# EAGLE design IMUinator2368 v2 (EAGLE 6.2)
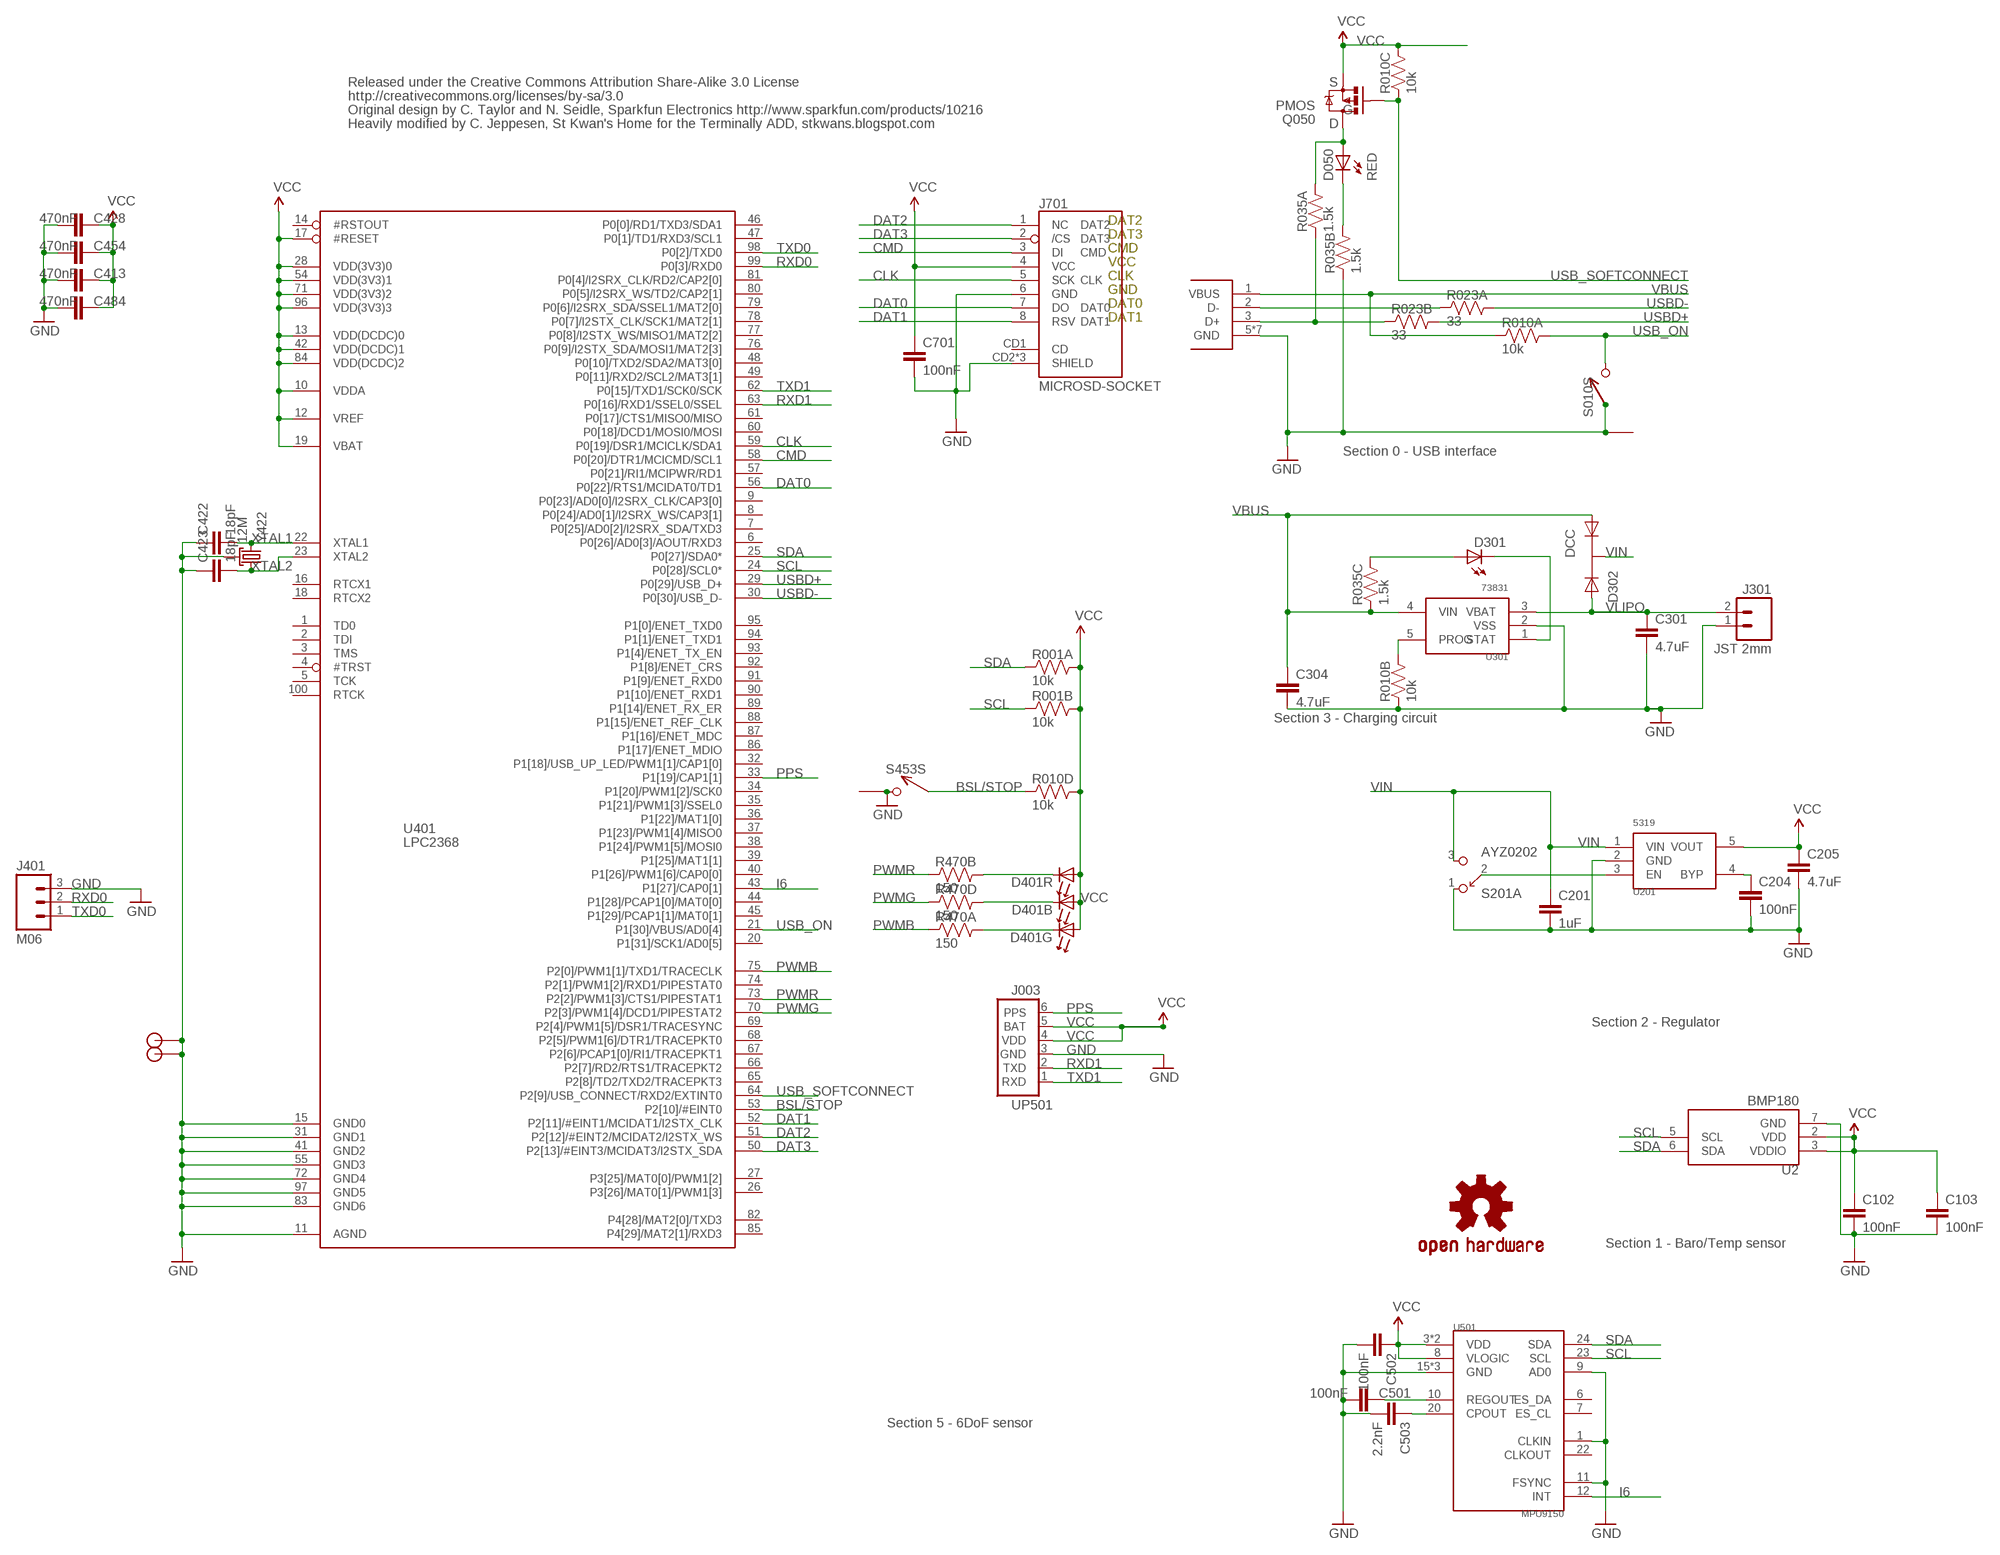
[diagram p0: schematic, sheet 1]

## Parts
C102  100nF  CAP0402-CAP  [0402-CAP]
C103  100nF  CAP0402-CAP  [0402-CAP]
C201  1uF  CAP0402-CAP  [0402-CAP]
C204  100nF  CAP0402-CAP  [0402-CAP]
C205  4.7uF  CAP0402-CAP  [0402-CAP]
C301  4.7uF  CAP0402-CAP  [0402-CAP]
C304  4.7uF  CAP0402-CAP  [0402-CAP]
C413  470nF  CAP0402-CAP  [0402-CAP]
C422  18pF  CAP0402-CAP  [0402-CAP]
C423  18pF  CAP0402-CAP  [0402-CAP]
C428  470nF  CAP0402-CAP  [0402-CAP]
C454  470nF  CAP0402-CAP  [0402-CAP]
C484  470nF  CAP0402-CAP  [0402-CAP]
C501  100nF  CAP0402-CAP  [0402-CAP]
C502  100nF  CAP0402-CAP  [0402-CAP]
C503  2.2nF  CAP0402-CAP  [0402-CAP]
C701  100nF  CAP0402-CAP  [0402-CAP]
D050  RED  LED0603  [LED-0603]
D301  RED  LED0603  [LED-0603]
D302  DCC  PMEG2005CT  [SOT-23-3]
D401  SMLP36RGB2W(R)  [SMLP36]
J001  USB_MICROB_JSTGCT  [USB_MICROB_3075]
J003  UP501  [UP501]
J301  JST 2mm  M02-JST-2MM-SMT  [JST-2-SMD]
J401  M06  M03PTH  [1X03]
J701  MICROSD-SOCKET  [MICROSD-SOCKET-PP]
JP1  STANDOFF  [STANDOFF]
JP2  STANDOFF  [STANDOFF]
Q050  PMOS  MOSFET-PCHANNELSMD  [SOT23-3]
R001  10k  RP2EXB24V  [CRA02]
R010  10k  RP404  [CRA04]
R023  33  RP2EXB24V  [CRA02]
R035  1.5k  RP404  [CRA04]
R470  150  RP404  [CRA04]
S010  SPST  B3U-1100P  [B3U-1100P]
S201  AYZ0202  [AYZ0202]
S453  SPST  B3U-1100P  [B3U-1100P]
U2  BMP180  [BMP180]
U201  5319  MIC5319D5  [SOT-23-5]
U301  73831  MCP73831  [SOT-23-5]
U401  LPC2368  [LQFP100]
U501  MPU9150  [LLGA24]
U$3  OSHW-LOGOS  [OSHW-LOGO-S]
Y422  12M  CX2520  [CRYSTAL_SMD_2MM_2_5MM]

## Nets
BSL/STOP: R010.4 S453.P$1 U401.53(P2[10]/#EINT0)
CLK: J701.5(SCK) U401.59(P0[19]/DSR1/MCICLK/SDA1)
CMD: J701.3(DI) U401.58(P0[20]/DTR1/MCICMD/SCL1)
CONN_D+: J001.3(D+) R023.2 R035.1
CONN_D-: J001.2(D-) R023.1
DAT0: J701.7(DO) U401.56(P0[22]/RTS1/MCIDAT0/TD1)
DAT1: J701.8(RSV) U401.52(P2[11]/#EINT1/MCIDAT1/I2STX_CLK)
DAT2: J701.1(NC) U401.51(P2[12]/#EINT2/MCIDAT2/I2STX_WS)
DAT3: J701.2(/CS) U401.50(P2[13]/#EINT3/MCIDAT3/I2STX_SDA)
DB: D401.5(G:C) R470.8
DG: D401.3(R:C) R470.7
GND: C102.2 C103.2 C201.2 C204.2 C205.2 C301.2 C304.2 C413.2 C422.1 C423.1 C428.2 C454.2 C484.2 C501.2 C502.2 C503.2 C701.2 J001.5(GND) J001.P$1(GND) J001.P$2(GND) J001.P$3(GND) J001.P$4(GND) J001.P$8(GND) J001.P$10(GND) J003.3(GND) J301.1 J401.3 J701.6(GND) J701.CD2(SHIELD) J701.GND1(SHIELD) J701.GND3(SHIELD) JP1.P$1 JP2.P$1 R010.2 R035.2 S010.P$1 S010.P$3 S201.1 S453.P$2 S453.P$3 U2.7(GND) U201.2(GND) U301.2(VSS) U401.11(AGND) U401.15(GND0) U401.31(GND1) U401.41(GND2) U401.55(GND3) U401.72(GND4) U401.83(GND6) U401.97(GND5) U501.1(CLKIN) U501.9(AD0) U501.11(FSYNC) U501.15(GND) U501.17(GND) U501.18(GND) Y422.2(GND) Y422.4(GND)
I6: U401.43(P1[27]/CAP0[1]) U501.12(INT)
N$1: D301.A R035.6
N$2: C503.1 U501.20(CPOUT)
N$3: D401.1(B:C) R470.5
N$4: C501.1 U501.10(REGOUT)
N$6: D050.A Q050.3(D) R035.8
N$7: D050.C R035.7
N$17: C204.1 U201.4(BYP)
PPS: J003.6(PPS) U401.33(P1[19]/CAP1[1])
PWMB: R470.1 U401.75(P2[0]/PWM1[1]/TXD1/TRACECLK)
PWMG: R470.4 U401.70(P2[3]/PWM1[4]/DCD1/PIPESTAT2)
PWMR: R470.2 U401.73(P2[2]/PWM1[3]/CTS1/PIPESTAT1)
PWR_SWITCH: S201.2 U201.3(EN)
REG_PROG: R010.7 U301.5(PROG)
REG_STAT: D301.C U301.1(STAT)
RXD0: J401.2 U401.99(P0[3]/RXD0)
RXD1: J003.2(TXD) U401.63(P0[16]/RXD1/SSEL0/SSEL)
SCL: R001.2 U2.5(SCL) U401.24(P0[28]/SCL0*) U501.23(SCL)
SDA: R001.1 U2.6(SDA) U401.25(P0[27]/SDA0*) U501.24(SDA)
TXD0: J401.1 U401.98(P0[2]/TXD0)
TXD1: J003.1(RXD) U401.62(P0[15]/TXD1/SCK0/SCK)
USB_ON: R010.8 S010.P$2 U401.21(P1[30]/VBUS/AD0[4])
USB_SOFTCONNECT: Q050.1(G) R010.3 U401.64(P2[9]/USB_CONNECT/RXD2/EXTINT0)
USBD+: R023.3 U401.29(P0[29]/USB_D+)
USBD-: R023.4 U401.30(P0[30]/USB_D-)
VBUS [power]: C304.1 D302.1(A1) J001.1(VBUS) R010.1 R035.3 U301.4(VIN)
VCC: C102.1 C103.1 C205.1 C413.1 C428.1 C454.1 C484.1 C502.1 C701.1 D401.2(B:A) D401.4(R:A) D401.6(G:A) J003.4(VDD) J003.5(BAT) J701.4(VCC) Q050.2(S) R001.3 R001.4 R010.5 R010.6 U2.2(VDD) U2.3(VDDIO) U201.5(VOUT) U401.10(VDDA) U401.12(VREF) U401.13(VDD(DCDC)0) U401.17(#RESET) U401.19(VBAT) U401.28(VDD(3V3)0) U401.42(VDD(DCDC)1) U401.54(VDD(3V3)1) U401.71(VDD(3V3)2) U401.84(VDD(DCDC)2) U401.96(VDD(3V3)3) U501.3(VDD) U501.8(VLOGIC) U501.13(VDD)
VIN: C201.1 D302.3(K) S201.3 U201.1(VIN)
VLIPO [power]: C301.1 D302.2(A2) J301.2 U301.3(VBAT)
XTAL1: C422.2 U401.22(XTAL1) Y422.3
XTAL2: C423.2 U401.23(XTAL2) Y422.1
Unconnected: J701.CD1(CD) R035.4 R035.5 R470.3 R470.6 S201.4 S201.5 S201.6 U401.1(TD0) U401.2(TDI) U401.3(TMS) U401.4(#TRST) U401.5(TCK) U401.6(P0[26]/AD0[3]/AOUT/RXD3) U401.7(P0[25]/AD0[2]/I2SRX_SDA/TXD3) U401.8(P0[24]/AD0[1]/I2SRX_WS/CAP3[1]) U401.9(P0[23]/AD0[0]/I2SRX_CLK/CAP3[0]) U401.14(#RSTOUT) U401.16(RTCX1) U401.18(RTCX2) U401.20(P1[31]/SCK1/AD0[5]) U401.26(P3[26]/MAT0[1]/PWM1[3]) U401.27(P3[25]/MAT0[0]/PWM1[2]) U401.32(P1[18]/USB_UP_LED/PWM1[1]/CAP1[0]) U401.34(P1[20]/PWM1[2]/SCK0) U401.35(P1[21]/PWM1[3]/SSEL0) U401.36(P1[22]/MAT1[0]) U401.37(P1[23]/PWM1[4]/MISO0) U401.38(P1[24]/PWM1[5]/MOSI0) U401.39(P1[25]/MAT1[1]) U401.40(P1[26]/PWM1[6]/CAP0[0]) U401.44(P1[28]/PCAP1[0]/MAT0[0]) U401.45(P1[29]/PCAP1[1]/MAT0[1]) U401.46(P0[0]/RD1/TXD3/SDA1) U401.47(P0[1]/TD1/RXD3/SCL1) U401.48(P0[10]/TXD2/SDA2/MAT3[0]) U401.49(P0[11]/RXD2/SCL2/MAT3[1]) U401.57(P0[21]/RI1/MCIPWR/RD1) U401.60(P0[18]/DCD1/MOSI0/MOSI) U401.61(P0[17]/CTS1/MISO0/MISO) U401.65(P2[8]/TD2/TXD2/TRACEPKT3) U401.66(P2[7]/RD2/RTS1/TRACEPKT2) U401.67(P2[6]/PCAP1[0]/RI1/TRACEPKT1) U401.68(P2[5]/PWM1[6]/DTR1/TRACEPKT0) U401.69(P2[4]/PWM1[5]/DSR1/TRACESYNC) U401.74(P2[1]/PWM1[2]/RXD1/PIPESTAT0) U401.76(P0[9]/I2STX_SDA/MOSI1/MAT2[3]) U401.77(P0[8]/I2STX_WS/MISO1/MAT2[2]) U401.78(P0[7]/I2STX_CLK/SCK1/MAT2[1]) U401.79(P0[6]/I2SRX_SDA/SSEL1/MAT2[0]) U401.80(P0[5]/I2SRX_WS/TD2/CAP2[1]) U401.81(P0[4]/I2SRX_CLK/RD2/CAP2[0]) U401.82(P4[28]/MAT2[0]/TXD3) U401.85(P4[29]/MAT2[1]/RXD3) U401.86(P1[17]/ENET_MDIO) U401.87(P1[16]/ENET_MDC) U401.88(P1[15]/ENET_REF_CLK) U401.89(P1[14]/ENET_RX_ER) U401.90(P1[10]/ENET_RXD1) U401.91(P1[9]/ENET_RXD0) U401.92(P1[8]/ENET_CRS) U401.93(P1[4]/ENET_TX_EN) U401.94(P1[1]/ENET_TXD1) U401.95(P1[0]/ENET_TXD0) U401.100(RTCK) U501.6(ES_DA) U501.7(ES_CL) U501.22(CLKOUT)

## Notes on the sheet
- Released under the Creative Commons Attribution Share-Alike 3.0 License | S
- http://creativecommons.org/licenses/by-sa/3.0
- Original design by C. Taylor and N. Seidle, Sparkfun Electronics http://www.sparkfun.com/products/10216 | G
- Heavily modified by C. Jeppesen, St Kwan's Home for the Terminally ADD, stkwans.blogspot.com | D
- DAT2
- DAT3
- CMD
- VCC
- CLK
- GND
- DAT0
- DAT1
- Section 0 - USB interface
- Section 3 - Charging circuit
- Section 2 - Regulator
- Section 1 - Baro/Temp sensor
- Section 5 - 6DoF sensor

## Library data of the parts
C102 C103 C204 C428 C454 C484 C501-C503 C701 = SparkFun:CAP: Capacitor Standard 0603 ceramic capacitor, and 0.1" leaded capacitor.; DIGIKEY: 445-1268-1-ND
C201 = SparkFun:CAP: Capacitor Standard 0603 ceramic capacitor, and 0.1" leaded capacitor.; DIGIKEY: 445-1415-1-ND
C205 C301 C304 = SparkFun:CAP: Capacitor Standard 0603 ceramic capacitor, and 0.1" leaded capacitor.; DIGIKEY: 445-7395-1-ND
C413 = SparkFun:CAP: Capacitor Standard 0603 ceramic capacitor, and 0.1" leaded capacitor.; DIGIKEY: 445-4976-1-ND
C422 C423 = SparkFun:CAP: Capacitor Standard 0603 ceramic capacitor, and 0.1" leaded capacitor.; DIGIKEY: 445-1238-1-ND
D050 D301 = SparkFun:LED: LEDs Standard schematic elements and footprints for 5mm, 3mm, 1206, and 0603 sized LEDs. 5mm - Spark Fun Electronics SKU : COM-00529 (and others); DIGIKEY: 350-2029-1-ND
D302 = KwanSystems:PMEG2005CT; DIGIKEY: 568-6500-1-ND
D401 = KwanSystems:SMLP36RGB2W(R)
J001 = KwanSystems:USB_MICROB_JST; DIGIKEY: 455-2562-1-ND
J003 = KwanSystems:UP501; DIGIKEY: $NOPART
J301 = SparkFun:M02: Header 2 Standard 2-pin 0.1" header. Use with straight break away headers (SKU : PRT-00116), right angle break away headers (PRT-00553), swiss pins (PRT-00743), machine pins (PRT-00117), and female headers (PRT-00115). Molex polarized connector foot print use with SKU : PRT-08233 with associated crimp pins and housings.; DIGIKEY: 455-1749-1-ND
J401 = SparkFun-Connectors:M03: Header 3 Standard 3-pin 0.1" header. Use with straight break away headers (SKU : PRT-00116), right angle break away headers (PRT-00553), swiss pins (PRT-00743), machine pins (PRT-00117), and female headers (PRT-00115). Molex polarized connector foot print use with SKU : PRT-08232 with associated crimp pins and housings.; DIGIKEY: $NOPART
J701 = KwanSystems:MICROSD-SOCKET: microSD Socket Push-push type uSD socket. Digikey 101-00660-68-6-1-ND. tDoc lines correctly indicate media card edge positions when inserting (unlocked, locked, depressed).; DIGIKEY: 101-00581-59-1-ND
JP1 JP2 = KwanSystems:STANDOFF; DIGIKEY: $NOPART
Q050 = SparkFun:MOSFET-PCHANNEL; DIGIKEY: NTR1P02T1GOSCT-ND
R001 R023 = KwanSystems:RP2
R010 R035 R470 = KwanSystems:RP4
S010 S453 = KwanSystems:B3U-1100P; DIGIKEY: SW1021CT-ND
S201 = KwanSystems:AYZ0202
U2 = KwanSystems:BMP180; DIGIKEY: 828-1027-1-ND
U201 = KwanSystems:MIC5319; DIGIKEY: 576-1910-1-ND
U301 = KwanSystems:MCP73831; DIGIKEY: MCP73831T-2ACI/OTCT-ND
U401 = KwanSystems:LPC2368; DIGIKEY: 568-3997-ND
U501 = KwanSystems:MPU9150
U$3 = SparkFun:OSHW-LOGO: Open Source Hardware Logo This logo indicates the piece of hardware it is found on incorporates a OSHW license and/or adheres to the definition of open source hardware found here: http://freedomdefined.org/OSHW; DIGIKEY: $NOPART
Y422 = KwanSystems:CX2520; DIGIKEY: 887-1316-1-ND

## Net classes
0 default: width 0.152 mm, drill 0.33 mm, clearance 0.152 mm
1 power: width 0.152 mm, drill 0.33 mm, clearance 0.152 mm to class 0, clearance 0.152 mm
2 hv: width 0.152 mm, drill 0.33 mm, clearance 0.152 mm to class 0, clearance 0.152 mm to class 1, clearance 0.152 mm

## Board
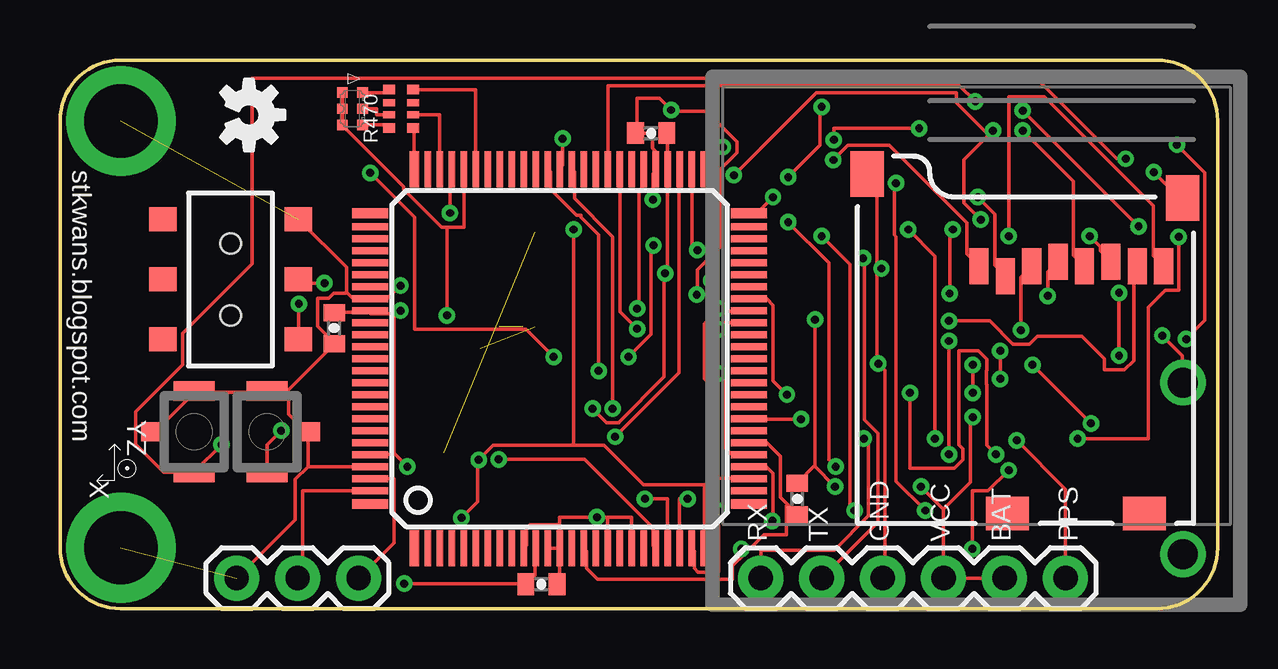
[diagram p1: board, top side]
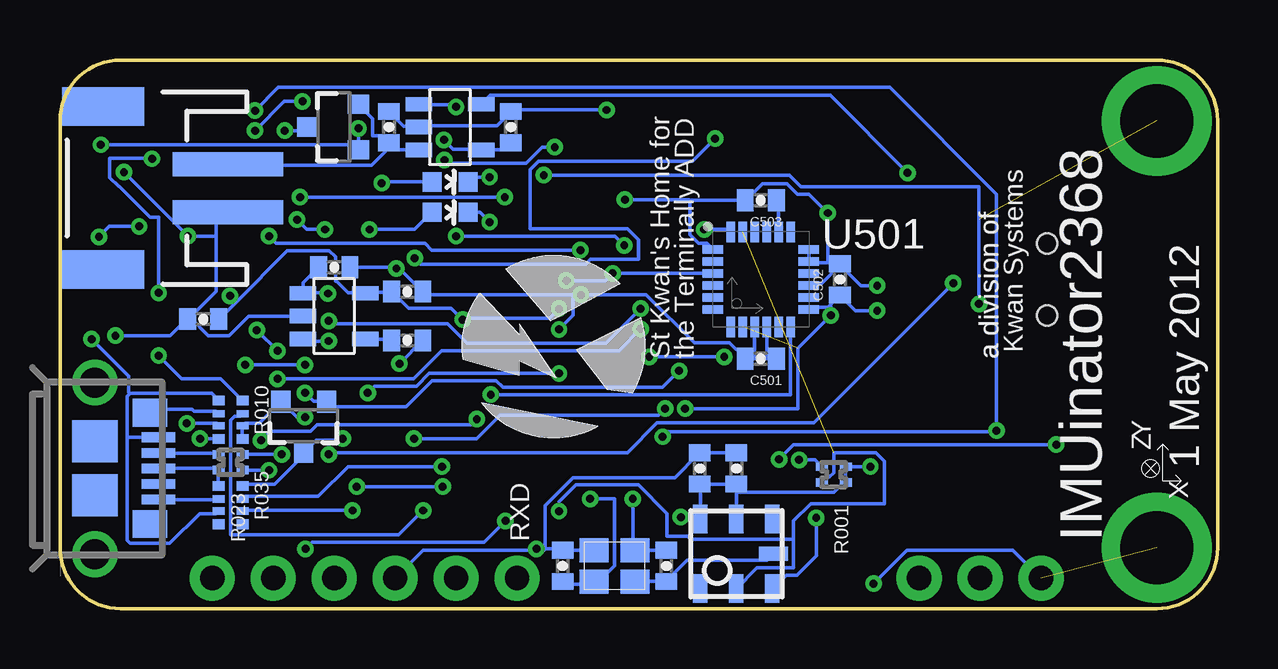
[diagram p2: board, bottom side, seen from below]

Size 48.26 x 22.86 mm. Coordinates in mm from the lower left corner, seen from the top.
Outline: 2.54,22.86 45.72,22.86 arc-90 48.26,20.32 48.26,2.54 arc-90 45.72,0 2.54,0 arc-90 0,2.54 0,20.32 arc-90 2.54,22.86
Copper layers (1*16): Top 0.0356mm / dielectric 1.5011mm / Bottom 0.0356mm
Design rules: minimum track width 6mil, minimum drill 13mil, track to track 6mil, track to pad 6mil, pad to pad 6mil, via to via 6mil, smd to smd 6mil, copper to edge 15mil, drill to drill 6mil, minimum pad ring 7mil, minimum via ring 7mil, stop-mask expansion 4mil, vias tented up to drill 14mil, thermal gap 10mil

### Footprints (pad centres in the part's own frame; a part is rotated, then mirrored left to right if it is on the bottom)
0402-CAP = smd 0.7 x 0.9: 1 -0.65,0; 2 0.65,0
LED-0603 = smd 0.8 x 0.8: A 0,-0.75; C 0,0.75
SOT-23-3 = smd 0.9 x 0.8: 1 -1,0.95; 2 -1,-0.95; 3 1.1,0
SMLP36 = smd 0.45 x 0.45: 1 -0.675,0.425; 2 -0.675,-0.425; 5 0.675,0.425; 6 0.675,-0.425 | smd 0.4 x 0.45: 3 0,0.425; 4 0,-0.425
USB_MICROB_3075 = smd 0.4 x 1.4: 1 -1.3,4.1; 2 -0.65,4.1; 3 0,4.1; 4 0.65,4.1; 5 1.3,4.1 | smd 1.15 x 1.45: P$1 2.32,3.75; P$10 -2.32,3.75 | smd 1.75 x 1.9: P$2 1.125,1.45; P$8 -1.125,1.45 | drill 1.25 pad 1.9: P$3 -3.575,1.45; P$4 3.575,1.45
UP501 = drill 1.016 pad 1.88: 1 0,0; 2 2.54,0; 3 5.08,0; 4 7.62,0; 5 10.16,0; 6 12.7,0
JST-2-SMD = smd 1 x 4.6: 1 -1,-3.7; 2 1,-3.7 | smd 1.6 x 3.4: NC1 -3.4,1.5; NC2 3.4,1.5
1X03 = drill 1.016 pad 1.88: 1 0,0; 2 2.54,0; 3 5.08,0
MICROSD-SOCKET-PP = smd 0.8 x 1.5: 1 -8.94,10.7; 2 -7.84,10.3; 3 -6.74,10.7; 4 -5.64,10.9; 5 -4.54,10.7; 6 -3.44,10.9; 7 -2.34,10.7; 8 -1.24,10.7 | smd 1.8 x 1.4: CD1 -2.05,0.4; CD2 -7.75,0.4 | smd 1.4 x 1.9: GND1 -13.6,14.55; GND3 -0.45,13.55
STANDOFF = drill 3.048 pad 4.572: P$1 0,0
SOT23-3 = smd 0.8 x 0.9: 1 -0.95,-1; 2 0.95,-1; 3 0,1.1
CRA02 = smd 0.35 x 0.5: 1 -0.325,-0.5; 2 0.325,-0.5; 3 0.325,0.5; 4 -0.325,0.5
CRA04 = smd 0.4 x 0.5: 1 -0.8,-0.5; 4 0.8,-0.5; 5 0.8,0.5; 8 -0.8,0.5 | smd 0.3 x 0.5: 2 -0.25,-0.5; 3 0.25,-0.5; 6 0.25,0.5; 7 -0.25,0.5
B3U-1100P = smd 0.8 x 1.7: P$1 -1.7,0; P$2 1.7,0 | smd 0.8 x 1.1: P$3 0,-1.65
AYZ0202 = smd 1 x 1.15: 1 -2.5,2.825; 2 0,2.825; 3 2.5,2.825; 4 -2.5,-2.825; 5 0,-2.825; 6 2.5,-2.825 | hole 0.85: 1.5,0; -1.5,0
BMP180 = smd 0.6 x 1.2: 1 1.5,1.45; 2 0,1.45; 3 -1.5,1.45; 4 -1.5,-1.45; 5 0,-1.45; 6 1.5,-1.45 | smd 1.2 x 0.6: 7 1.55,0
SOT-23-5 = smd 0.6 x 1.1: 1 -0.95,-1.3; 2 0,-1.3; 3 0.95,-1.3; 4 0.95,1.3; 5 -0.95,1.3
LQFP100 = smd 1.5 x 0.4: 1 -7.9,6.06; 25 -7.9,-6.06; 51 7.9,-6.06; 75 7.9,6.06 | smd 1.5 x 0.28: 2 -7.9,5.5; 3 -7.9,5; 4 -7.9,4.5; 5 -7.9,4; 6 -7.9,3.5; 7 -7.9,3; 8 -7.9,2.5; 9 -7.9,2; 10 -7.9,1.5; 11 -7.9,1; 12 -7.9,0.5; 13 -7.9,0; 14 -7.9,-0.5; 15 -7.9,-1; 16 -7.9,-1.5; 17 -7.9,-2; 18 -7.9,-2.5; 19 -7.9,-3; 20 -7.9,-3.5; 21 -7.9,-4; 22 -7.9,-4.5; 23 -7.9,-5; 24 -7.9,-5.5; 52 7.9,-5.5; 53 7.9,-5; 54 7.9,-4.5; 55 7.9,-4; 56 7.9,-3.5; 57 7.9,-3; 58 7.9,-2.5; 59 7.9,-2; 60 7.9,-1.5; 61 7.9,-1; 62 7.9,-0.5; 63 7.9,0; 64 7.9,0.5; 65 7.9,1; 66 7.9,1.5; 67 7.9,2; 68 7.9,2.5; 69 7.9,3; 70 7.9,3.5; 71 7.9,4; 72 7.9,4.5; 73 7.9,5; 74 7.9,5.5 | smd 0.4 x 1.5: 26 -6.06,-7.9; 50 6.06,-7.9; 76 6.06,7.9; 100 -6.06,7.9 | smd 0.28 x 1.5: 27 -5.5,-7.9; 28 -5,-7.9; 29 -4.5,-7.9; 30 -4,-7.9; 31 -3.5,-7.9; 32 -3,-7.9; 33 -2.5,-7.9; 34 -2,-7.9; 35 -1.5,-7.9; 36 -1,-7.9; 37 -0.5,-7.9; 38 0,-7.9; 39 0.5,-7.9; 40 1,-7.9; 41 1.5,-7.9; 42 2,-7.9; 43 2.5,-7.9; 44 3,-7.9; 45 3.5,-7.9; 46 4,-7.9; 47 4.5,-7.9; 48 5,-7.9; 49 5.5,-7.9; 77 5.5,7.9; 78 5,7.9; 79 4.5,7.9; 80 4,7.9; 81 3.5,7.9; 82 3,7.9; 83 2.5,7.9; 84 2,7.9; 85 1.5,7.9; 86 1,7.9; 87 0.5,7.9; 88 0,7.9; 89 -0.5,7.9; 90 -1,7.9; 91 -1.5,7.9; 92 -2,7.9; 93 -2.5,7.9; 94 -3,7.9; 95 -3.5,7.9; 96 -4,7.9; 97 -4.5,7.9; 98 -5,7.9; 99 -5.5,7.9
LLGA24 = smd 0.85 x 0.34: 1 -2,1.25; 2 -2,0.75; 3 -2,0.25; 4 -2,-0.25; 5 -2,-0.75; 6 -2,-1.25; 13 2,-1.25; 14 2,-0.75; 15 2,-0.25; 16 2,0.25; 17 2,0.75; 18 2,1.25 | smd 0.34 x 0.85: 7 -1.25,-1.975; 8 -0.75,-1.975; 9 -0.25,-1.975; 10 0.25,-1.975; 11 0.75,-1.975; 12 1.25,-1.975; 19 1.25,1.975; 20 0.75,1.975; 21 0.25,1.975; 22 -0.25,1.975; 23 -0.75,1.975; 24 -1.25,1.975
CRYSTAL_SMD_2MM_2_5MM = smd 1.2 x 1: 1 -0.85,-0.65; 2 0.85,-0.65; 3 0.85,0.65; 4 -0.85,0.65

### Placement (x,y rotation side)
C102  20.07,5.84 90 bottom
C103  21.59,5.84 90 bottom
C201  36.83,14.22 0 bottom
C204  33.78,11.18 0 bottom
C205  33.78,13.21 0 bottom
C301  34.54,20.07 90 bottom
C304  29.46,20.07 90 bottom
C413  20.07,1.02 180 top
C422  22.99,1.78 90 bottom
C423  27.3,1.78 270 bottom
C428  30.73,4.57 270 top
C454  24.64,19.81 180 top
C484  11.43,11.68 270 top
C501  19.05,10.41 180 bottom
C502  15.75,13.72 90 bottom
C503  19.05,17.02 180 bottom
C701  42.29,12.06 180 bottom
D050  32,16.51 270 bottom
D301  32,17.78 270 bottom
D302  36.83,20.07 180 bottom
D401  12.19,20.83 270 top
J001  48.26,5.84 270 bottom
J003  29.21,1.27 0 top
J301  44.96,17.53 90 bottom
J401  12.45,1.27 180 top
J701  47.24,3.56 0 top
JP1  2.54,2.54 0 top
JP2  2.54,20.32 0 top
Q050  38.1,7.62 180 bottom
R001  16,5.59 270 bottom
R010  41.15,7.87 270 bottom
R023  41.15,6.1 270 bottom
R035  41.15,4.32 270 bottom
R470  14.22,20.83 90 top
S010  5.59,7.37 270 top
S201  7.11,13.72 270 top
S453  8.64,7.37 90 top
U2  20.07,2.29 0 bottom
U201  36.83,12.19 270 bottom
U301  32,20.07 270 bottom
U401  20.83,10.41 90 top
U501  19.05,13.72 0 bottom
U$1  [KWAN_CIRCLE]  27.69,10.92 90 bottom
U$3  7.87,20.57 270 top
Y422  25.15,1.78 0 bottom

### Tracks (layer width: path | path; a pad name or v marks a point on that pad's centre or on a via)
BSL/STOP  (via drill 0.33)
  Top 0.152: v42.42,7.09 45.36,7.09 45.36,12.55 46.08,13.26 46.63,13.26 v46.63,15.49 | v40.13,20.75 v44.96,15.93 | v9.22,7.42 8.64,6.83 S453.P$1 | v23.14,7.16 25.81,9.83 25.81,18.31 U401.53
  Bottom 0.152: v42.42,7.09 41.66,7.09 R010.4 | v46.63,15.49 46.2,15.93 v44.96,15.93 | v40.13,20.75 39.17,21.72 13.66,21.72 9.22,17.27 v9.22,7.42 9.27,7.37 22.94,7.37 v23.14,7.16
CLK  (via drill 0.33)
  Top 0.152: v40.13,19.91 42.24,17.8 42.24,14.73 42.7,14.28 J701.5 | v38.15,21.13 37.49,21.79 22.84,21.79 22.84,18.34 U401.59
  Bottom 0.152: v40.13,19.91 38.91,21.13 v38.15,21.13
CMD  (via drill 0.33)
  Top 0.152: v40.06,11.61 40.06,13.82 40.49,14.25 J701.3 | v39.19,9.58 v39.19,10.74 | v24.05,11.66 23.34,12.37 23.34,18.31 U401.58
  Bottom 0.152: v39.19,10.74 v40.06,11.61 | v39.19,9.58 33.53,9.58 32.36,10.74 24.97,10.74 v24.05,11.66
CONN_D+
  Bottom 0.152: R035.1 R023.2 41.73,5.77 41.81,5.84 J001.3
CONN_D-
  Bottom 0.152: R023.1 41.71,6.48 44.15,6.48 J001.2
DAT0  (via drill 0.33)
  Top 0.152: v37.06,11.99 38.76,11.99 39.73,11.02 40.41,11.02 40.74,11.35 42.6,11.35 43.54,10.41 43.54,9.96 44.37,9.96 44.76,10.34 44.76,14.12 44.88,14.25 J701.7 | v24.05,12.5 24.13,12.57 24.13,17.4 24.31,17.58 24.31,18.31 U401.56
  Bottom 0.152: v37.06,11.99 36.93,11.86 32.11,11.86 31.29,11.05 25.5,11.05 v24.05,12.5
DAT1  (via drill 0.33)
  Top 0.152: v39.55,15.52 39.55,21.34 41.02,21.34 45.57,16.79 45.57,14.71 46,14.28 J701.8 | v26.57,14.94 26.34,15.16 U401.52
  Bottom 0.152: v39.55,15.52 39.24,15.21 33.05,15.21 32.77,14.94 v26.57,14.94
DAT2  (via drill 0.33)
  Top 0.152: v32.23,18.69 32.84,19.3 34.57,19.3 37.8,16.08 37.8,14.78 38.3,14.28 J701.1 | v27.64,19.23 26.9,18.49 26.9,18.34 U401.51
  Bottom 0.152: v32.23,18.69 32.11,18.57 28.83,18.57 28.17,19.23 v27.64,19.23
DAT3  (via drill 0.33)
  Top 0.152: v38.25,17.14 38.96,16.43 38.96,14.3 J701.2 | v29.72,17.14 29.06,16.48 28.75,16.48 U401.50
  Bottom 0.152: v29.72,17.14 v38.25,17.14
DB
  Top 0.152: R470.8 13.72,20.15 D401.5
DG
  Top 0.152: R470.7 13.21,20.58 13.21,20.83 D401.3
GND  (via drill 0.33)  (3 unrouted)
  Top 0.152: v42.93,15.52 43.36,15.09 43.36,14.91 43.79,14.48 J701.6 | v45.95,11.38 46.79,10.54 46.79,9.42 J001.P$3 | 30.33,4.34 30.02,4.65 30.02,6.35 29.46,6.91 28.75,6.91 U401.31 | 30.33,4.34 30.73,3.94 C428.2 | 28.57,2.31 29.34,3.07 30.28,3.07 30.28,4.29 30.33,4.34 | 28.57,2.31 28.04,1.78 28.04,1.22 22.4,1.22 21.95,1.68 21.95,2.39 21.84,2.49 U401.15 | v28.4,2.49 28.57,2.31 | v27.46,11.63 27.46,11.91 U401.41 | 34.06,14.17 34.06,17.68 33.66,18.09 J701.GND1 | 34.06,14.17 34.06,10.26 v34.11,10.21 34.39,9.93 34.39,1.37 J003.3 | 34.06,14.17 v34.24,14.17 | v45.59,18.19 46.66,17.12 J701.GND3 | v16.26,16.48 16.26,18.26 16.31,18.31 U401.72 | v24.71,17.04 24.71,18.11 24.84,18.24 U401.55 24.82,18.34 24.82,19.05 24.69,19.18 24.69,19.81 C454.2 24.05,19.86 24.05,21.26 24.99,21.26 v25.48,20.78 25.53,20.73 26.95,20.73 28.22,19.46 28.22,19 27.51,18.29 27.51,15.06 26.57,14.12 26.57,13.11 v26.54,13.08 | U401.11 19.81,2.49 19.81,1.4 19.43,1.02 C413.2 19.36,1.04 v14.35,1.04 | 11.94,13.18 11.94,14.22 9.96,16.2 S201.1 | 11.94,13.18 12.19,12.93 12.9,12.93 U401.83 13.01,12.9 13.64,12.9 v14.2,13.46 | S010.P$3 3.96,7.37 5.59,8.99 S010.P$1 5.64,9.02 8.59,9.02 S453.P$2 9.47,9.07 | 9.47,9.07 C484.2 11.4,11.1 10.74,11.76 10.74,12.93 11.2,12.93 11.4,13.13 11.89,13.13 11.94,13.18 | 9.47,9.07 9.53,9.02 9.53,8.1 10.26,7.37 S453.P$3 10.34,7.32 10.34,5.92 | 10.34,5.92 12.9,5.92 U401.97 | J401.3 9.8,3.71 9.8,5.38 10.34,5.92
  Bottom 0.152: 41.76,15.52 41.76,16.51 41.27,16.51 J301.1 | 41.76,15.52 41.76,13.23 42.93,12.06 C701.2 | U201.2 40.39,12.19 41.2,11.38 42.09,11.38 42.8,12.09 C701.2 | 41.76,15.52 v42.93,15.52 v45.59,18.19 | R035.2 41.66,4.55 44.15,4.55 J001.5 | R010.2 41.76,8.23 42.67,8.23 42.75,8.31 44.37,8.31 44.5,8.18 J001.P$10 | v45.95,11.38 43.66,11.38 43,12.04 C701.2 | C102.2 20.07,6.5 21.59,6.5 C103.2 21.64,6.45 22.63,5.46 26.87,5.46 28.04,4.29 28.04,2.49 | U2.7 18.57,2.23 18.8,2.01 22.12,2.01 22.94,1.19 C422.1 22.99,1.14 24.28,1.14 Y422.2 | Y422.4 C423.1 27.36,2.49 28.04,2.49 | J003.3 33.12,2.44 28.4,2.44 | 28.4,2.44 28.09,2.44 28.04,2.49 | v28.4,2.49 28.4,2.44 | U501.9 19.3,10.41 C501.2 19.74,10.46 20.34,11.07 21.82,11.07 23.82,13.08 v26.54,13.08 26.87,13.08 | C201.2 34.24,14.22 | 34.24,14.22 34.16,14.22 33.15,13.21 C205.2 33.07,13.18 32.97,13.08 26.87,13.08 | v27.46,11.63 26.87,12.22 26.87,13.08 | v34.11,10.21 33.15,11.18 C204.2 | v34.24,14.17 34.24,14.22 | U501.18 U501.17 16.97,14.48 16.89,14.4 16.26,14.4 | C502.2 15.75,14.33 16.51,13.56 16.97,13.56 17.04,13.49 U501.15 | 16.26,14.4 15.8,14.4 C502.2 | 16.26,14.4 v16.26,16.48 17.04,17.27 17.53,17.27 17.96,17.7 18.97,17.7 19.63,17.04 C503.2 22,17.02 | C301.2 34.54,20.7 33.93,20.09 33.38,20.09 U301.2 33.25,20.12 30.05,20.12 29.46,20.7 C304.2 29.41,20.75 29.39,20.78 v25.48,20.78 | 22,17.02 22,15.57 21.64,15.21 21.29,15.21 21.06,14.99 U501.1 | v24.71,17.04 22.05,17.04 22,17.02 | v14.35,1.04 12.95,2.44 8.53,2.44 J401.3 | v14.2,13.46 14.88,13.46 15.7,14.28 C502.2
I6  (via drill 0.33)
  Top 0.152: v30.3,8.91 29.72,9.5 29.72,12.65 29.46,12.9 28.75,12.9 U401.43
  Bottom 0.152: v30.3,8.91 17.8,8.91 U501.12
N$1  (via drill 0.33)
  Top 0.152: v36.07,4.09 34.85,5.31 34.85,15.49 34.77,15.57 34.77,17.65 v34.85,17.73
  Bottom 0.152: v36.07,4.09 40.64,4.09 R035.6 | v34.85,17.73 34.8,17.78 D301.A
N$2
  Bottom 0.152: C503.1 18.31,17.02 18.31,15.7 U501.20
N$3
  Top 0.152: R470.5 13.72,21.5 D401.1
N$4
  Bottom 0.152: C501.1 18.8,10.41 U501.10
N$6  (via drill 0.33)
  Top 0.152: v35.36,15.8 36.47,14.68 v36.47,7.09
  Bottom 0.152: R035.8 40.59,5.18 39.32,5.18 38.1,6.4 Q050.3 38.05,6.55 37.59,7.01 36.55,7.01 v36.47,7.09 | v35.36,15.8 33.48,15.8 32.77,16.51 D050.A
N$7  (via drill 0.33)
  Top 0.152: v32.33,5.92 32.05,6.2 32.05,14.4 v30.35,16.1
  Bottom 0.152: v32.33,5.92 36.25,5.92 37.49,4.67 40.54,4.67 R035.7 | v30.35,16.1 30.76,16.51 D050.C
N$17
  Bottom 0.152: C204.1 34.44,11.18 34.49,11.23 35.51,11.23 U201.4
PPS  (via drill 0.33)
  Top 0.152: v30.89,7.9 28.75,7.9 U401.33 | v39.88,7.01 41.91,4.98 J003.6
  Bottom 0.152: v30.89,7.9 31.11,7.67 37.54,7.67 37.82,7.39 39.5,7.39 v39.88,7.01
PWMB
  Top 0.152: U401.75 14.77,19.98 R470.1
PWMG
  Top 0.152: U401.70 17.33,21.63 R470.4
PWMR
  Top 0.152: U401.73 15.83,20.58 R470.2
PWR_SWITCH  (via drill 0.33)
  Top 0.152: v37.06,6.43 v37.06,11.15 | v11.02,13.56 9.96,13.56 9.96,13.72 S201.2
  Bottom 0.152: v37.06,11.15 38.05,11.15 38.12,11.23 U201.3 | v37.06,6.43 36.98,6.5 24.61,6.5 23.37,7.75 16.84,7.75 v11.02,13.56
REG_PROG  (via drill 0.33)
  Top 0.152: v33.12,4.09 32.92,4.29 32.92,14.35 v31.75,15.52 | v24.74,15.14 24.64,15.04 24.64,11.43 v23.7,10.49 | v20.57,10.49 19.43,11.63 14.78,11.63 14.78,16.31 v12.93,18.16
  Bottom 0.152: v33.12,4.09 34.14,3.07 41.15,3.07 41.15,7.85 40.97,8.03 40.74,8.03 40.66,8.1 R010.7 | v31.75,15.52 25.12,15.52 v24.74,15.14 | v20.57,10.49 v23.7,10.49 | v12.93,18.16 16.15,21.39 30.33,21.39 30.68,21.03 U301.5
REG_STAT  (via drill 0.33)
  Top 0.152: v30.35,17.98 31.67,19.3 31.67,20.83 v31.75,20.9
  Bottom 0.152: v30.35,17.98 31.04,17.98 D301.C | v31.75,20.9 31.85,21.01 33.3,21.01 U301.1
RXD0
  Top 0.152: J401.2 10.11,1.47 10.11,4.9 12.9,4.9 U401.99
RXD1  (via drill 0.33)
  Top 0.152: v20.95,19.58 20.95,18.47 20.83,18.34 U401.63 | v33.48,14.61 33.53,14.55 33.53,7.87 34.09,7.32 34.09,3.61 J003.2
  Bottom 0.152: v20.95,19.58 21.89,18.64 28.32,18.64 28.68,18.29 28.68,15.82 24.61,15.82 24.16,15.37 24.16,14.55 26.14,14.55 26.34,14.35 33.22,14.35 v33.48,14.61
SCL  (via drill 0.33)  (1 unrouted)
  Top 0.152: v27.46,4.06 27.46,1.52 26.59,1.52 26.44,1.68 26.44,2.39 26.34,2.49 U401.24
  Bottom 0.152: 17.68,2.9 17.68,1.7 19.2,1.7 U2.5 | 17.68,2.9 17.68,3.66 16.97,4.37 13.89,4.37 13.89,6.15 14.25,6.5 16,6.5 16,5.66 16.18,5.49 16.28,5.49 16.48,5.28 R001.2 | v27.46,4.06 27.46,4.45 26.75,5.16 24.16,5.16 22.96,3.96 22.96,3.02 22.1,3.02 21.97,2.9 17.68,2.9
SDA  (via drill 0.33)
  Top 0.152: 21.41,6.81 22.68,6.81 24.33,5.16 26.87,5.16 26.87,2.52 U401.25 | 21.41,6.81 18.06,6.81 v17.45,6.2 17.4,6.15 17.4,4.45 v16.74,3.79 | 21.41,6.81 v21.41,15.8
  Bottom 0.152: v17.45,6.2 16.79,6.2 R001.1 | v21.41,15.8 20.42,15.8 20.32,15.7 U501.24 | v16.74,3.79 16.74,2.21 17.55,1.4 17.98,1.4 18.54,0.84 U2.6
TXD0
  Top 0.152: J401.1 13.92,2.74 13.92,5.41 U401.98
TXD1  (via drill 0.33)
  Top 0.152: v23.04,8.33 23.04,15.49 21.44,17.09 21.44,18.21 U401.62 | v33.5,7.09 33.71,6.88 33.71,3.86 32.28,2.44 29.21,2.44 J003.1
  Bottom 0.152: v23.04,8.33 23.32,8.05 29.92,8.05 30.89,7.09 v33.5,7.09
USB_ON  (via drill 0.33)
  Top 0.152: v44.15,13.16 v44.15,10.54 | v44.42,18.75 44.04,18.75 40.69,22.1 8,22.1 8,14.38 5.11,11.48 5.11,10.16 3.15,8.2 3.15,6.86 4.32,5.69 5.59,5.69 S010.P$2 5.64,5.74 v6.73,6.83 | v18.29,6.22 21.87,6.22 24.71,3.38 24.71,2.62 24.82,2.52 U401.21
  Bottom 0.152: v44.15,10.54 43.18,9.58 41.55,9.58 40.66,8.69 R010.8 | v44.15,13.16 44.15,16.31 44.5,16.31 45.8,17.6 45.82,17.6 46.18,17.96 46.18,18.77 44.45,18.77 v44.42,18.75 | v18.29,6.22 17.68,6.83 v6.73,6.83
USB_SOFTCONNECT  (via drill 0.33)
  Top 0.152: v40.54,10.16 v42.98,7.72 | v38.05,8.99 v38.05,10.16 | v22.45,9.91 22.45,15.57 21.72,16.31 21.72,16.38 21.54,16.38 20.45,17.48 20.45,18.21 20.34,18.31 U401.64
  Bottom 0.152: v42.98,7.72 41.73,7.72 41.66,7.64 R010.3 | v38.05,10.16 v40.54,10.16 | v38.05,8.99 37.69,8.64 37.16,8.64 Q050.1 37.08,8.59 36.91,8.41 33.83,8.41 32.74,9.5 30.07,9.5 29.79,9.22 23.14,9.22 v22.45,9.91
USBD+  (via drill 0.33)
  Top 0.152: v39.55,5.77 38.68,4.9 38.02,4.9 v38.02,2.49 | v29.69,3.66 29.72,3.68 29.72,5.64 29.46,5.89 28.75,5.89 U401.29
  Bottom 0.152: v39.55,5.77 R023.3 | v38.02,2.49 37.74,2.77 30.58,2.77 v29.69,3.66
USBD-  (via drill 0.33)
  Top 0.152: v39.01,6.43 38.63,6.81 38.63,9.32 38.61,9.35 38.61,9.91 38.63,9.93 38.63,10.39 38.28,10.74 37.47,10.74 37.47,6.83 37.64,6.66 37.64,6.2 37.29,5.84 35.43,5.84 v35.43,8.99 | v27.46,9.8 27.74,9.53 27.74,6.68 27.99,6.43 28.73,6.43 U401.30
  Bottom 0.152: v39.01,6.43 R023.4 | v35.43,8.99 35.15,9.27 33.4,9.27 32.87,9.8 v27.46,9.8
VBUS  (via drill 0.33)
  Top 0.152: v35.81,20.02 32.26,20.02 v32.26,19.53 | v46.56,19.33 47.73,18.16 47.73,12.01 v46.94,11.23
  Bottom 0.152: C304.1 29.46,19.41 29.74,19.13 30.68,19.13 U301.4 30.76,19.15 31.88,19.15 v32.26,19.53 | v35.81,20.02 35.81,19.13 D302.1 35.87,19.33 v46.56,19.33 | 45.47,7.14 45.47,2.85 45.34,2.72 43.69,2.72 42.44,3.96 41.76,3.96 R035.3 | 45.47,7.14 J001.1 | 45.34,8.97 41.94,8.97 41.66,8.69 R010.1 | 45.34,8.97 45.47,8.84 45.47,7.14 | v46.94,11.23 45.39,9.68 45.39,9.02 45.34,8.97
VCC  (via drill 0.33)  (1 unrouted)
  Top 0.152: C413.1 20.83,1.02 U401.13 | U401.12 U401.13 | U401.13 20.83,3.5 | 20.83,3.5 20.83,3.81 v22.38,3.81 22.83,3.81 | 22.83,3.81 U401.17 | 22.83,3.81 23.83,3.81 U401.19 | C454.1 25.33,19.81 U401.54 25.32,18.26 25.32,14.07 v25.22,13.97 25.17,13.92 25.17,9.65 23.29,7.77 23.29,7.75 22.78,7.75 v22.2,8.33 | D401.2 11.79,21.49 11.79,20.88 D401.4 11.79,20.83 11.79,20.17 D401.6 11.81,20.09 14.33,17.58 14.33,17.48 15.9,15.9 16.13,15.9 | 16.13,15.9 16.84,15.9 U401.71 | 20.83,3.5 19.58,3.5 19.46,3.38 19.46,2.64 U401.10 | C484.1 11.43,12.34 12.9,12.34 12.9,12.39 U401.84 12.95,12.29 13.77,12.29 13.92,12.14 | 13.92,6.43 12.93,6.43 U401.96 | 13.92,12.14 13.92,6.43 | 13.92,12.14 v14.2,12.42 | v14.48,5.92 13.97,6.43 13.92,6.43 | v16.13,12.22 16.13,15.9 | 27.41,12.39 26.87,11.86 26.87,9.58 27.03,9.42 27.03,5.44 28.73,5.44 U401.28 | 27.41,12.39 28.73,12.39 U401.42 | v27.15,13.66 27.36,13.46 27.36,12.45 27.38,12.42 | 27.38,12.42 27.41,12.39 | v38.05,7.98 37.95,7.87 37.95,5.26 36.83,4.14 | 36.83,4.14 J003.4 J003.5 | v41.17,13.03 41.17,14.05 41.58,14.45 J701.4 | 31.45,5.94 31.47,5.97 v31.47,12.04 | 31.45,5.94 30.73,5.23 C428.1 | v35.89,5.08 36.83,4.14 | 31.45,5.94 v32.31,5.08 | v27.46,12.5 27.38,12.42
  Bottom 0.152: C102.1 U2.2 | U2.3 21.57,5.19 C103.1 C102.1 | U2.3 21.59,3.74 21.59,3.81 | C102.1 20.02,4.85 16,4.85 15.6,5.26 R001.3 15.52,5.28 15.52,5.89 R001.4 15.44,5.92 v14.48,5.92 | v22.38,3.81 21.64,3.81 U2.3 | 16.18,12.62 15.75,13.06 C502.1 15.7,13.01 15.11,12.42 v14.2,12.42 | 16.18,12.62 16.26,12.55 16.97,12.55 U501.13 | 16.18,12.62 16.13,12.57 v16.13,12.22 17.5,10.85 17.5,8.33 v22.2,8.33 | U501.3 v25.22,13.97 25.53,13.66 v27.15,13.66 | R010.5 40.66,7.09 40.66,7.62 R010.6 40.59,7.67 40.54,7.72 39.95,7.72 39.06,8.61 Q050.2 38.99,8.59 38.38,7.98 v38.05,7.98 | 40.92,12.78 38.79,14.91 37.03,14.91 36.78,14.66 36.78,13.64 36.73,13.64 36.25,13.16 35.53,13.16 U201.5 35.46,13.16 35.43,13.18 34.49,13.18 C205.1 34.42,13.21 33.73,12.52 31.95,12.52 v31.47,12.04 31.42,12.09 27.86,12.09 v27.46,12.5 | 40.92,12.78 C701.1 | 40.92,12.78 v41.17,13.03 | v32.31,5.08 v35.89,5.08
VIN  (via drill 0.33)
  Top 0.152: v38.38,16.2 37.67,16.92 37.67,18.69 v38.89,19.91 38.66,19.79 37.36,21.08 37.36,21.49 31.52,21.49 v28.09,18.06 | v37.21,15.8 37.08,15.67 v37.08,13.13 | v9.96,12.7 9.96,11.23 S201.3
  Bottom 0.152: C201.1 38.12,13.59 38.12,13.16 U201.1 38.05,13.16 37.11,13.16 v37.08,13.13 | v38.89,19.91 38.1,19.91 37.95,20.07 D302.3 | v38.38,16.2 37.97,15.8 v37.21,15.8 | v9.96,12.7 9.96,17.58 17.37,17.58 17.86,18.06 v28.09,18.06
VLIPO
  Bottom 0.152: C301.1 34.54,19.41 34.27,19.13 33.33,19.13 U301.3 | D302.2 35.81,21.01 35.23,20.42 35.23,19.71 34.85,19.71 34.59,19.46 C301.1 | C301.1 34.49,19.25 35.28,18.47 41.2,18.47 41.25,18.52 J301.2
XTAL1  (via drill 0.33)
  Top 0.152: v24.38,4.57 25.33,4.57 U401.22
  Bottom 0.152: C422.2 Y422.3 24.38,2.43 v24.38,4.57
XTAL2  (via drill 0.33)
  Top 0.152: v26.16,4.57 25.83,4.57 U401.23
  Bottom 0.152: C423.2 27.18,1.13 27.18,1.02 26,1.02 Y422.1 25.8,1.13 25.15,1.78 25.15,4.57 v26.16,4.57

### Text on the board
tPlace: stkwans.blogspot.com | Y | Z | X | RX | TX | GND | VCC | BAT | PPS
bPlace: Kwan Systems | a division of | a division of | the Terminally ADD | St Kwan's Home for | Y | Z | 1 May 2012 | X | IMUinator2368 | RXD
Document: Released under the Creative Commons Attribution Share-Alike 3.0 License | http://creativecommons.org/licenses/by-sa/3.0 | Original design by C. Taylor and N. Seidle, Sparkfun Electronics http://www.sparkfun.com/products/10216 | Heavily modified by C. Jeppesen, St Kwan's Home for the Terminally ADD, stkwans.blogspot.com